# Altium project ZynqSOCHSADDA12BHS.PrjPcb
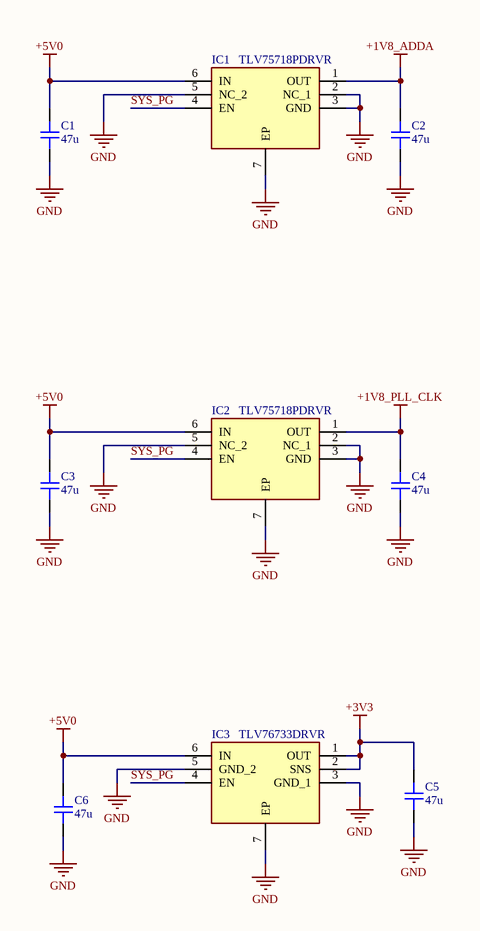
[diagram p0: HSADDAPower.SchDoc]
6 sheets, 134 parts. Net scope: global (net labels, ports and power ports of the same name join across sheets).
Board file: HSADDAModule.PcbDoc
Sheets:
  HSADDAPower.SchDoc
  MezzanineConnectors.SchDoc
  ClockGen.SchDoc
  HSADCircuit.SchDoc
  HSDACircuit.SchDoc
  SerialTerminations.SchDoc

## Sheet HSADDAPower.SchDoc
size A4; SheetNumber: 1; SheetTotal: 4

### Parts
C1  47u  [CAP_0805]
C2  47u  [CAP_0805]
C3  47u  [CAP_0805]
C4  47u  [CAP_0805]
C5  47u  [CAP_0805]
C6  47u  [CAP_0805]
IC1  TLV75718PDRVR  [SON65P200X200X80-7N]
IC2  TLV75718PDRVR  [SON65P200X200X80-7N]
IC3  TLV76733DRVR  [SON65P200X200X80-7N]

### Nets
+1V8_ADDA: C2.2 IC1.1(OUT)
+1V8_PLL_CLK: C4.2 IC2.1(OUT)
+3V3: C5.2 IC3.1(OUT) IC3.2(SNS)
+5V0: C1.2 C3.2 C6.2 IC1.6(IN) IC2.6(IN) IC3.6(IN)
GND: C1.1 C2.1 C3.1 C4.1 C5.1 C6.1 IC1.2(NC_1) IC1.3(GND) IC1.5(NC_2) IC1.7(EP) IC2.2(NC_1) IC2.3(GND) IC2.5(NC_2) IC2.7(EP) IC3.3(GND_1) IC3.5(GND_2) IC3.7(EP)
SYS_PG: IC1.4(EN) IC2.4(EN) IC3.4(EN)

### Library data of the parts
C1-C6 = CAP_0805: Capacitor SMD 0805; Manufacturer: *; Manufacturer Part Number: *; Distributor Link: *; LCSC: *; Rating: *; Dielectric: *
IC1 IC2 = TLV75718PDRVR: Integrated Circuit; Manufacturer_Name: Texas Instruments; Datasheet Link: http://www.ti.com/lit/gpn/tlv757p; Height: 0.8mm; Manufacturer_Part_Number: TLV75718PDRVR; Mouser Part Number: 595-TLV75718PDRVR; Mouser Price/Stock: https://www.mouser.co.uk/ProductDetail/Texas-Instruments/TLV75718PDRVR?qs=W0yvOO0ixfFI17Xta%2FsYdw%3D%3D; Arrow Part Number: TLV75718PDRVR; Arrow Price/Stock: https://www.arrow.com/en/products/tlv75718pdrvr/texas-instruments
IC3 = TLV76733DRVR: Integrated Circuit; Manufacturer_Name: Texas Instruments; Datasheet Link: http://www.ti.com/lit/gpn/TLV767; Height: 0.8mm; Manufacturer_Part_Number: TLV76733DRVR; Mouser Part Number: 595-TLV76733DRVR; Mouser Price/Stock: https://www.mouser.co.uk/ProductDetail/Texas-Instruments/TLV76733DRVR?qs=9r4v7xj2LnmGIkwTuPlHig%3D%3D; Arrow Part Number: TLV76733DRVR; Arrow Price/Stock: https://www.arrow.com/en/products/tlv76733drvr/texas-instruments?region=nac

## Sheet MezzanineConnectors.SchDoc
size A3; SheetNumber: 2; SheetTotal: 6
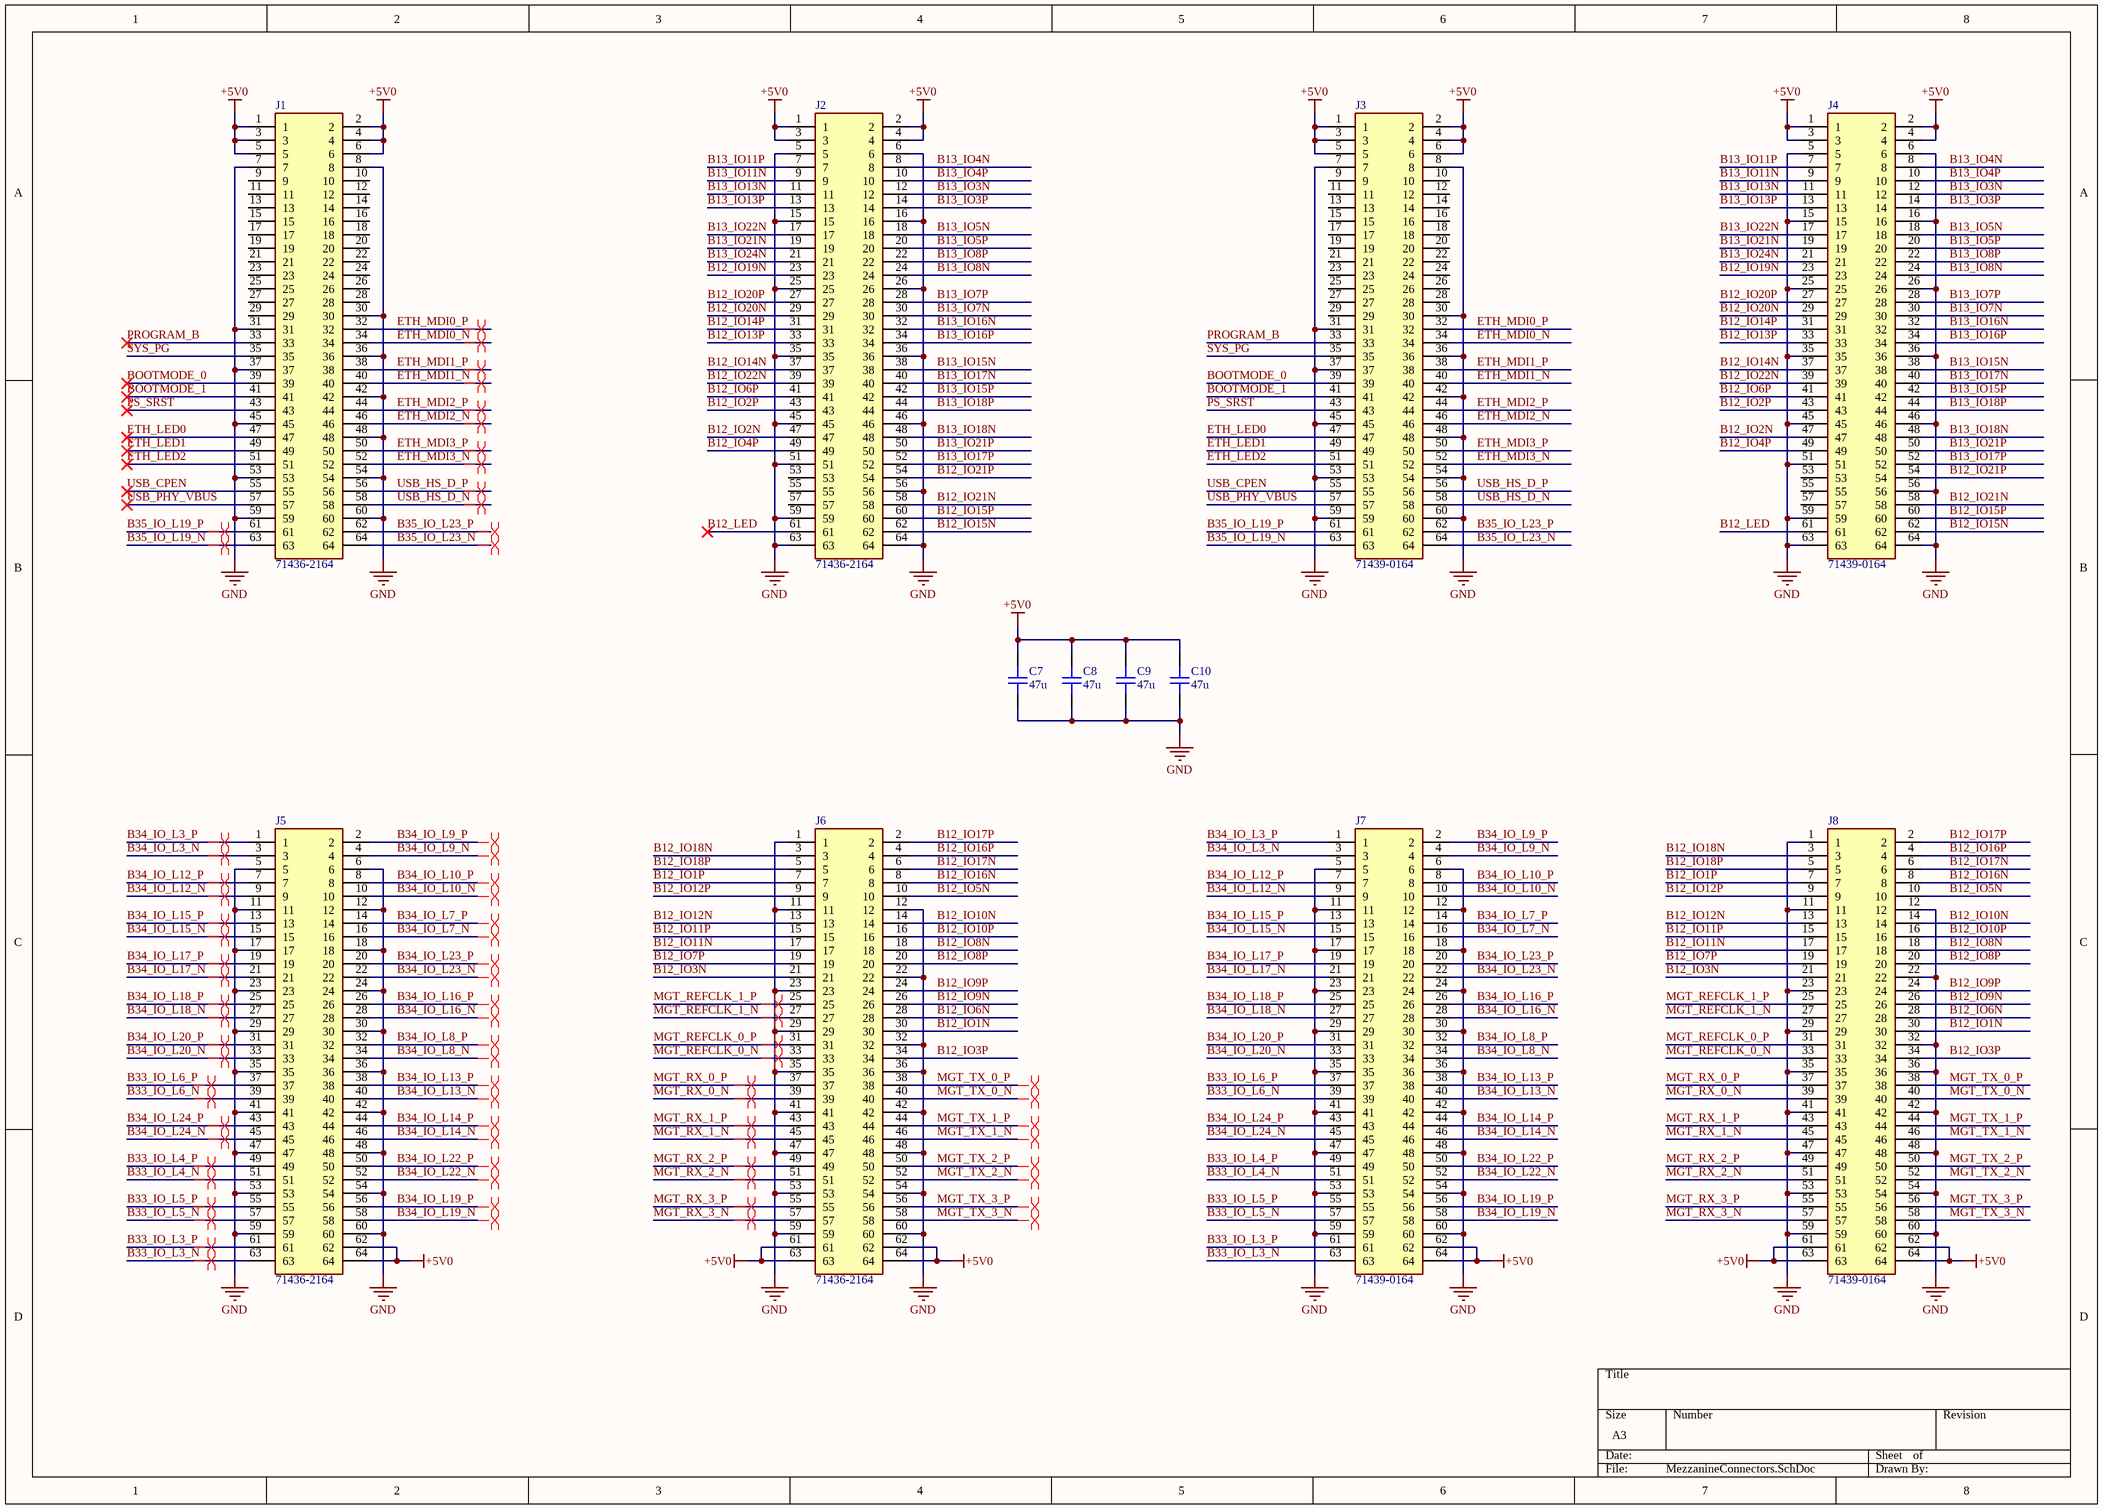
[diagram p1: MezzanineConnectors.SchDoc]

### Parts
C7  47u  [CAP_0805]
C8  47u  [CAP_0805]
C9  47u  [CAP_0805]
C10  47u  [CAP_0805]
J1  71436-2164  [714362164]
J2  71436-2164  [714362164]
J3  71439-0164  [714390164]
J4  71439-0164  [714390164]
J5  71436-2164  [714362164]
J6  71436-2164  [714362164]
J7  71439-0164  [714390164]
J8  71439-0164  [714390164]

### Nets
+5V0: C7.2 C8.2 C9.2 C10.2 J1.1 J1.2 J1.3 J1.4 J1.5 J1.6 J2.1 J2.2 J2.3 J2.4 J3.1 J3.2 J3.3 J3.4 J3.5 J3.6 J4.1 J4.2 J4.3 J4.4 J5.62 J5.64 J6.61 J6.62 J6.63 J6.64 J7.62 J7.64 J8.61 J8.62 J8.63 J8.64
GND: C7.1 C8.1 C9.1 C10.1 J1.7 J1.8 J1.30 J1.31 J1.36 J1.37 J1.42 J1.45 J1.48 J1.53 J1.54 J1.59 J1.60 J2.5 J2.6 J2.15 J2.16 J2.25 J2.26 J2.35 J2.36 J2.45 J2.46 J2.51 J2.56 J2.59 J2.63 J2.64 J3.7 J3.8 J3.30 J3.31 J3.36 J3.37 J3.42 J3.45 J3.48 J3.53 J3.54 J3.59 J3.60 J4.5 J4.6 J4.15 J4.16 J4.25 J4.26 J4.35 J4.36 J4.45 J4.46 J4.51 J4.56 J4.59 J4.63 J4.64 J5.5 J5.6 J5.11 J5.12 J5.17 J5.18 J5.23 J5.24 J5.29 J5.30 J5.35 J5.36 J5.41 J5.42 J5.47 J5.48 J5.53 J5.54 J5.59 J5.60 J6.1 J6.11 J6.12 J6.22 J6.23 J6.29 J6.32 J6.35 J6.36 J6.41 J6.42 J6.47 J6.48 J6.53 J6.54 J6.59 J6.60 J7.5 J7.6 J7.11 J7.12 J7.17 J7.18 J7.23 J7.24 J7.29 J7.30 J7.35 J7.36 J7.41 J7.42 J7.47 J7.48 J7.53 J7.54 J7.59 J7.60 J8.1 J8.11 J8.12 J8.22 J8.23 J8.29 J8.32 J8.35 J8.36 J8.41 J8.42 J8.47 J8.48 J8.53 J8.54 J8.59 J8.60
B12_IO1N: J6.30 J8.30
B12_IO1P: J6.7 J8.7
B12_IO2N: J2.47 J4.47
B12_IO2P: J2.43 J4.43
B12_IO3N: J6.21 J8.21
B12_IO3P: J6.34 J8.34
B12_IO4P: J2.49 J4.49
B12_IO5N: J6.10 J8.10
B12_IO6N: J6.28 J8.28
B12_IO6P: J2.41 J4.41
B12_IO7P: J6.19 J8.19
B12_IO8N: J6.18 J8.18
B12_IO8P: J6.20 J8.20
B12_IO9N: J6.26 J8.26
B12_IO9P: J6.24 J8.24
B12_IO10N: J6.14 J8.14
B12_IO10P: J6.16 J8.16
B12_IO11N: J6.17 J8.17
B12_IO11P: J6.15 J8.15
B12_IO12N: J6.13 J8.13
B12_IO12P: J6.9 J8.9
B12_IO13P: J2.33 J4.33
B12_IO14N: J2.37 J4.37
B12_IO14P: J2.31 J4.31
B12_IO15N: J2.62 J4.62
B12_IO15P: J2.60 J4.60
B12_IO16N: J6.8 J8.8
B12_IO16P: J6.4 J8.4
B12_IO17N: J6.6 J8.6
B12_IO17P: J6.2 J8.2
B12_IO18N: J6.3 J8.3
B12_IO18P: J6.5 J8.5
B12_IO19N: J2.23 J4.23
B12_IO20N: J2.29 J4.29
B12_IO20P: J2.27 J4.27
B12_IO21N: J2.58 J4.58
B12_IO21P: J2.54 J4.54
B12_IO22N: J2.39 J4.39
B12_LED: J2.61 J4.61
B13_IO3N: J2.12 J4.12
B13_IO3P: J2.14 J4.14
B13_IO4N: J2.8 J4.8
B13_IO4P: J2.10 J4.10
B13_IO5N: J2.18 J4.18
B13_IO5P: J2.20 J4.20
B13_IO7N: J2.30 J4.30
B13_IO7P: J2.28 J4.28
B13_IO8N: J2.24 J4.24
B13_IO8P: J2.22 J4.22
B13_IO11N: J2.9 J4.9
B13_IO11P: J2.7 J4.7
B13_IO13N: J2.11 J4.11
B13_IO13P: J2.13 J4.13
B13_IO15N: J2.38 J4.38
B13_IO15P: J2.42 J4.42
B13_IO16N: J2.32 J4.32
B13_IO16P: J2.34 J4.34
B13_IO17N: J2.40 J4.40
B13_IO17P: J2.52 J4.52
B13_IO18N: J2.48 J4.48
B13_IO18P: J2.44 J4.44
B13_IO21N: J2.19 J4.19
B13_IO21P: J2.50 J4.50
B13_IO22N: J2.17 J4.17
B13_IO24N: J2.21 J4.21
B33_IO_L3_N: J5.63 J7.63
B33_IO_L3_P: J5.61 J7.61
B33_IO_L4_N: J5.51 J7.51
B33_IO_L4_P: J5.49 J7.49
B33_IO_L5_N: J5.57 J7.57
B33_IO_L5_P: J5.55 J7.55
B33_IO_L6_N: J5.39 J7.39
B33_IO_L6_P: J5.37 J7.37
B34_IO_L3_N: J5.3 J7.3
B34_IO_L3_P: J5.1 J7.1
B34_IO_L7_N: J5.16 J7.16
B34_IO_L7_P: J5.14 J7.14
B34_IO_L8_N: J5.34 J7.34
B34_IO_L8_P: J5.32 J7.32
B34_IO_L9_N: J5.4 J7.4
B34_IO_L9_P: J5.2 J7.2
B34_IO_L10_N: J5.10 J7.10
B34_IO_L10_P: J5.8 J7.8
B34_IO_L12_N: J5.9 J7.9
B34_IO_L12_P: J5.7 J7.7
B34_IO_L13_N: J5.40 J7.40
B34_IO_L13_P: J5.38 J7.38
B34_IO_L14_N: J5.46 J7.46
B34_IO_L14_P: J5.44 J7.44
B34_IO_L15_N: J5.15 J7.15
B34_IO_L15_P: J5.13 J7.13
B34_IO_L16_N: J5.28 J7.28
B34_IO_L16_P: J5.26 J7.26
B34_IO_L17_N: J5.21 J7.21
B34_IO_L17_P: J5.19 J7.19
B34_IO_L18_N: J5.27 J7.27
B34_IO_L18_P: J5.25 J7.25
B34_IO_L19_N: J5.58 J7.58
B34_IO_L19_P: J5.56 J7.56
B34_IO_L20_N: J5.33 J7.33
B34_IO_L20_P: J5.31 J7.31
B34_IO_L22_N: J5.52 J7.52
B34_IO_L22_P: J5.50 J7.50
B34_IO_L23_N: J5.22 J7.22
B34_IO_L23_P: J5.20 J7.20
B34_IO_L24_N: J5.45 J7.45
B34_IO_L24_P: J5.43 J7.43
B35_IO_L19_N: J1.63 J3.63
B35_IO_L19_P: J1.61 J3.61
B35_IO_L23_N: J1.64 J3.64
B35_IO_L23_P: J1.62 J3.62
BOOTMODE_0: J1.39 J3.39
BOOTMODE_1: J1.41 J3.41
ETH_LED0: J1.47 J3.47
ETH_LED1: J1.49 J3.49
ETH_LED2: J1.51 J3.51
ETH_MDI0_N: J1.34 J3.34
ETH_MDI0_P: J1.32 J3.32
ETH_MDI1_N: J1.40 J3.40
ETH_MDI1_P: J1.38 J3.38
ETH_MDI2_N: J1.46 J3.46
ETH_MDI2_P: J1.44 J3.44
ETH_MDI3_N: J1.52 J3.52
ETH_MDI3_P: J1.50 J3.50
MGT_REFCLK_0_N: J6.33 J8.33
MGT_REFCLK_0_P: J6.31 J8.31
MGT_REFCLK_1_N: J6.27 J8.27
MGT_REFCLK_1_P: J6.25 J8.25
MGT_RX_0_N: J6.39 J8.39
MGT_RX_0_P: J6.37 J8.37
MGT_RX_1_N: J6.45 J8.45
MGT_RX_1_P: J6.43 J8.43
MGT_RX_2_N: J6.51 J8.51
MGT_RX_2_P: J6.49 J8.49
MGT_RX_3_N: J6.57 J8.57
MGT_RX_3_P: J6.55 J8.55
MGT_TX_0_N: J6.40 J8.40
MGT_TX_0_P: J6.38 J8.38
MGT_TX_1_N: J6.46 J8.46
MGT_TX_1_P: J6.44 J8.44
MGT_TX_2_N: J6.52 J8.52
MGT_TX_2_P: J6.50 J8.50
MGT_TX_3_N: J6.58 J8.58
MGT_TX_3_P: J6.56 J8.56
PROGRAM_B: J1.33 J3.33
PS_SRST: J1.43 J3.43
SYS_PG: J1.35 J3.35
USB_CPEN: J1.55 J3.55
USB_HS_D_N: J1.58 J3.58
USB_HS_D_P: J1.56 J3.56
USB_PHY_VBUS: J1.57 J3.57

Not connected (* = marked no-connect by the designer): J1 9 10 11 12 13 14 15 16 17 18 19 20 21 22 23 24 25 26 27 28 29; J2 53 55 57; J3 9 10 11 12 13 14 15 16 17 18 19 20 21 22 23 24 25 26 27 28 29; J4 53 55 57

### Layout directives
differential pair: B33_IO_L3_N, B33_IO_L3_P, B33_IO_L4_N, B33_IO_L4_P, B33_IO_L5_N, B33_IO_L5_P, B33_IO_L6_N, B33_IO_L6_P, B34_IO_L3_N, B34_IO_L3_P, B34_IO_L7_N, B34_IO_L7_P, B34_IO_L8_N, B34_IO_L8_P, B34_IO_L9_N, B34_IO_L9_P, B34_IO_L10_N, B34_IO_L10_P, B34_IO_L12_N, B34_IO_L12_P, B34_IO_L13_N, B34_IO_L13_P, B34_IO_L14_N, B34_IO_L14_P, B34_IO_L15_N, B34_IO_L15_P, B34_IO_L16_N, B34_IO_L16_P, B34_IO_L17_N, B34_IO_L17_P, B34_IO_L18_N, B34_IO_L18_P, B34_IO_L19_N, B34_IO_L19_P, B34_IO_L20_N, B34_IO_L20_P, B34_IO_L22_N, B34_IO_L22_P, B34_IO_L23_N, B34_IO_L23_P, B34_IO_L24_N, B34_IO_L24_P, B35_IO_L19_N, B35_IO_L19_P, B35_IO_L23_N, B35_IO_L23_P, ETH_MDI0_N, ETH_MDI0_P, ETH_MDI1_N, ETH_MDI1_P, ETH_MDI2_N, ETH_MDI2_P, ETH_MDI3_N, ETH_MDI3_P, MGT_REFCLK_0_N, MGT_REFCLK_0_P, MGT_REFCLK_1_N, MGT_REFCLK_1_P, MGT_RX_0_N, MGT_RX_0_P, MGT_RX_1_N, MGT_RX_1_P, MGT_RX_2_N, MGT_RX_2_P, MGT_RX_3_N, MGT_RX_3_P, MGT_TX_0_N, MGT_TX_0_P, MGT_TX_1_N, MGT_TX_1_P, MGT_TX_2_N, MGT_TX_2_P, MGT_TX_3_N, MGT_TX_3_P, USB_HS_D_N, USB_HS_D_P

### Library data of the parts
C7-C10 = CAP_0805: Capacitor SMD 0805; Manufacturer: *; Manufacturer Part Number: *; Distributor Link: *; LCSC: *; Rating: *; Dielectric: *
J1 J2 J5 J6 = 71436-2164: Molex MEZZANINE Series, Series Number 71436, 1mm Pitch 64 Way 2 Row Straight PCB Header, Solder Termination, 1A; Geometry.Height: 8.48mm; Mouser Part Number: 538-71436-2164; Mouser Price/Stock: https://www.mouser.co.uk/ProductDetail/Molex/71436-2164?qs=X1mjqRbeMc536fw4qEA%252B%252Bg%3D%3D; Manufacturer_Name: Molex; Manufacturer_Part_Number: 71436-2164; Datasheet Link: *
J3 J4 J7 J8 = 71439-0164: Board to Board & Mezzanine Connectors PMC RECEPTACLE SMT; Manufacturer_Name: Molex; Datasheet Link: https://componentsearchengine.com/Datasheets/1/71439-0164.pdf; Height: 5.3mm; Manufacturer_Part_Number: 71439-0164; Mouser Part Number: 538-71439-0164; Mouser Price/Stock: https://www.mouser.co.uk/ProductDetail/Molex/71439-0164?qs=X1mjqRbeMc7uGUsAO8ttVw%3D%3D

## Sheet ClockGen.SchDoc
size A4; SheetNumber: 3; SheetTotal: 6
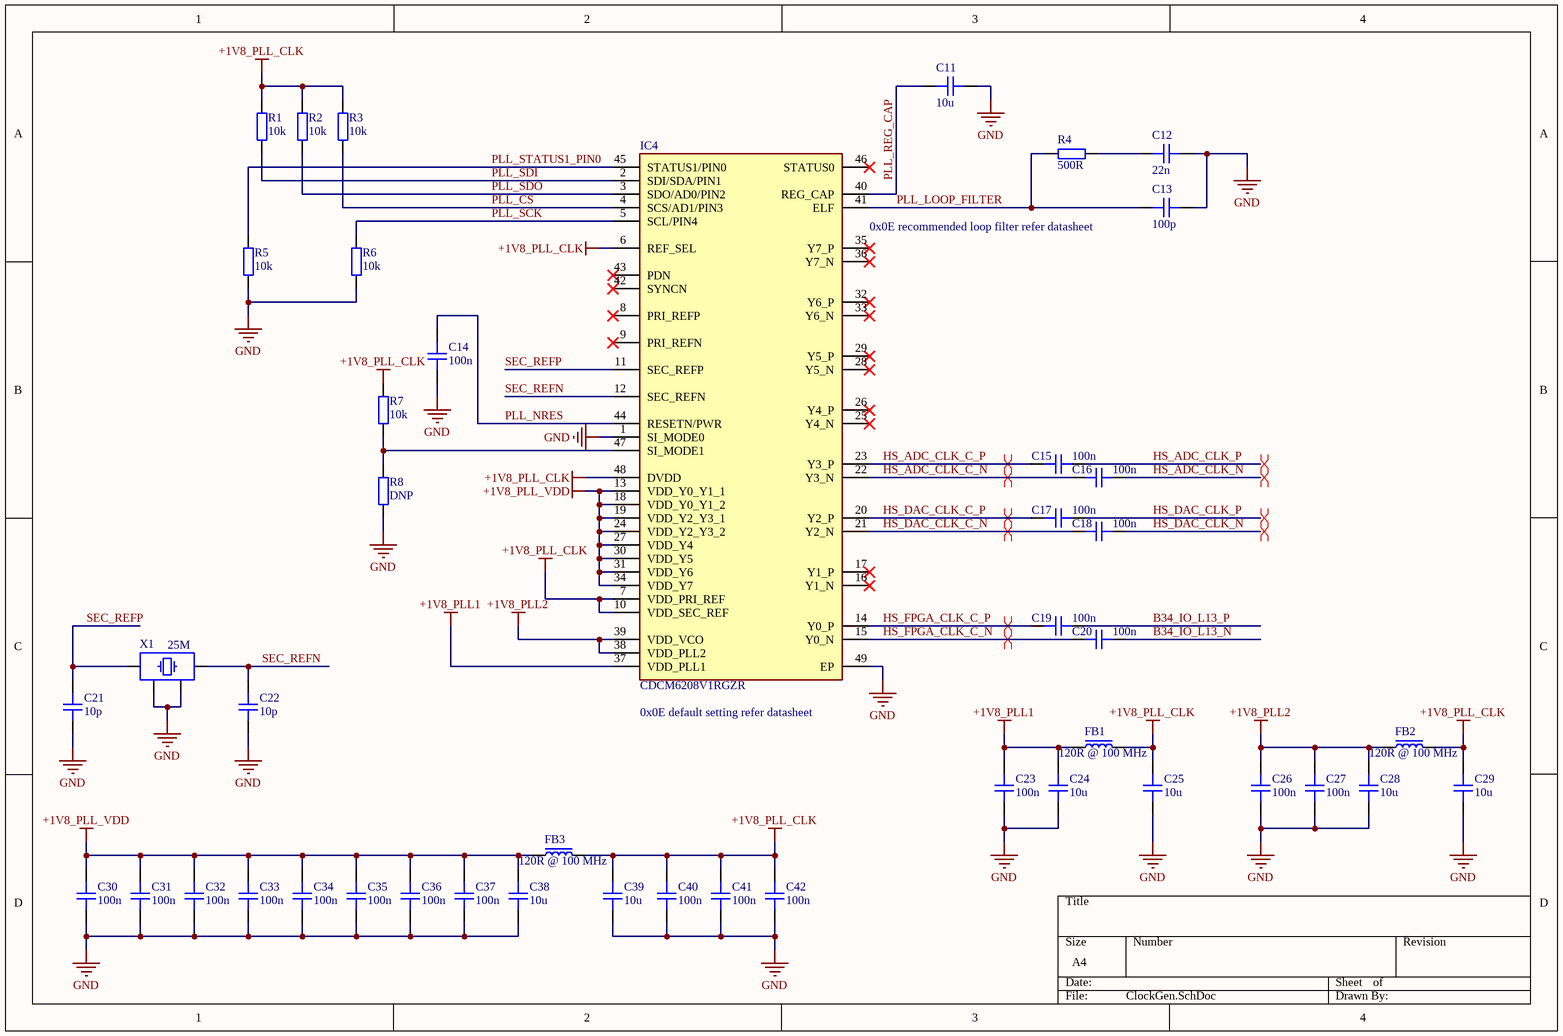
[diagram p2: ClockGen.SchDoc]

### Parts
C11  10u  [CAP_0603]
C12  22n  [CAP_0402]
C13  100p  [CAP_0402]
C14  100n  [CAP_0402]
C15  100n  [CAP_0402]
C16  100n  [CAP_0402]
C17  100n  [CAP_0402]
C18  100n  [CAP_0402]
C19  100n  [CAP_0402]
C20  100n  [CAP_0402]
C21  10p  [CAP_0402]
C22  10p  [CAP_0402]
C23  100n  [CAP_0402]
C24  10u  [CAP_0603]
C25  10u  [CAP_0603]
C26  100n  [CAP_0402]
C27  100n  [CAP_0402]
C28  10u  [CAP_0603]
C29  10u  [CAP_0603]
C30  100n  [CAP_0402]
C31  100n  [CAP_0402]
C32  100n  [CAP_0402]
C33  100n  [CAP_0402]
C34  100n  [CAP_0402]
C35  100n  [CAP_0402]
C36  100n  [CAP_0402]
C37  100n  [CAP_0402]
C38  10u  [CAP_0603]
C39  10u  [CAP_0603]
C40  100n  [CAP_0402]
C41  100n  [CAP_0402]
C42  100n  [CAP_0402]
FB1  120R @ 100 MHz  [FB_0603]
FB2  120R @ 100 MHz  [FB_0603]
FB3  120R @ 100 MHz  [FB_0603]
IC4  CDCM6208V1RGZR  [QFN50P700X700X100-49N-D - duplicate]
R1  10k  [RES_0402]
R2  10k  [RES_0402]
R3  10k  [RES_0402]
R4  500R  [RES_0402]
R5  10k  [RES_0402]
R6  10k  [RES_0402]
R7  10k  [RES_0402]
R8  DNP  [RES_0402]
X1  25M  [XTAL_3225]

### Nets
+1V8_PLL1: C23.1 C24.2 FB1.1 IC4.37(VDD_PLL1)
+1V8_PLL2: C26.1 C27.1 C28.2 FB2.1 IC4.38(VDD_PLL2) IC4.39(VDD_VCO)
+1V8_PLL_CLK: C25.2 C29.2 C39.2 C40.1 C41.1 C42.1 FB1.2 FB2.2 FB3.2 IC4.6(REF_SEL) IC4.7(VDD_PRI_REF) IC4.10(VDD_SEC_REF) IC4.48(DVDD) R1.2 R2.2 R3.2 R7.2
+1V8_PLL_VDD: C30.1 C31.1 C32.1 C33.1 C34.1 C35.1 C36.1 C37.1 C38.2 FB3.1 IC4.13(VDD_Y0_Y1_1) IC4.18(VDD_Y0_Y1_2) IC4.19(VDD_Y2_Y3_1) IC4.24(VDD_Y2_Y3_2) IC4.27(VDD_Y4) IC4.30(VDD_Y5) IC4.31(VDD_Y6) IC4.34(VDD_Y7)
GND: C11.2 C12.1 C13.1 C14.1 C21.2 C22.2 C23.2 C24.1 C25.1 C26.2 C27.2 C28.1 C29.1 C30.2 C31.2 C32.2 C33.2 C34.2 C35.2 C36.2 C37.2 C38.1 C39.1 C40.2 C41.2 C42.2 IC4.1(SI_MODE0) IC4.49(EP) R5.1 R6.1 R8.1 X1.2 X1.4
B34_IO_L13_N: C20.1
B34_IO_L13_P: C19.1
HS_ADC_CLK_C_N: C16.2 IC4.22(Y3_N)
HS_ADC_CLK_C_P: C15.2 IC4.23(Y3_P)
HS_ADC_CLK_N: C16.1
HS_ADC_CLK_P: C15.1
HS_DAC_CLK_C_N: C18.2 IC4.21(Y2_N)
HS_DAC_CLK_C_P: C17.2 IC4.20(Y2_P)
HS_DAC_CLK_N: C18.1
HS_DAC_CLK_P: C17.1
HS_FPGA_CLK_C_N: C20.2 IC4.15(Y0_N)
HS_FPGA_CLK_C_P: C19.2 IC4.14(Y0_P)
PLL_CS: IC4.4(SCS/AD1/PIN3) R3.1
PLL_LOOP_FILTER: C13.2 IC4.41(ELF) R4.2
PLL_NRES: C14.2 IC4.44(RESETN/PWR)
PLL_REG_CAP: C11.1 IC4.40(REG_CAP)
PLL_SCK: IC4.5(SCL/PIN4) R6.2
PLL_SDI: IC4.2(SDI/SDA/PIN1) R1.1
PLL_SDO: IC4.3(SDO/AD0/PIN2) R2.1
PLL_STATUS1_PIN0: IC4.45(STATUS1/PIN0) R5.2
SEC_REFN: C22.1 IC4.12(SEC_REFN) X1.3
SEC_REFP: C21.1 IC4.11(SEC_REFP) X1.1
NetC12_2: C12.2 R4.1
NetIC4_47: IC4.47(SI_MODE1) R7.1 R8.2

Not connected (* = marked no-connect by the designer): IC4 8(PRI_REFP)* 9(PRI_REFN)* 16(Y1_N)* 17(Y1_P)* 25(Y4_N)* 26(Y4_P)* 28(Y5_N)* 29(Y5_P)* 32(Y6_P)* 33(Y6_N)* 35(Y7_P)* 36(Y7_N)* 42(SYNCN)* 43(PDN)* 46(STATUS0)*

### Layout directives
differential pair: HS_ADC_CLK_C_N, HS_ADC_CLK_C_P, HS_ADC_CLK_N, HS_ADC_CLK_P, HS_DAC_CLK_C_N, HS_DAC_CLK_C_P, HS_DAC_CLK_N, HS_DAC_CLK_P, HS_FPGA_CLK_C_N, HS_FPGA_CLK_C_P

### Notes on the sheet
- 0x0E recommended loop filter refer datasheet
- (near IC4) 0x0E default setting refer datasheet

### Library data of the parts
C11 C24 C25 C28 C29 C38 C39 = CAP_0603: Capacitor SMD 0603; Manufacturer: *; Manufacturer Part Number: *; Distributor Link: *; LCSC: *; Rating: *; Dielectric: *
C12-C23 C26 C27 C30-C37 C40-C42 = CAP_0402: Capacitor SMD 0402; Manufacturer: *; Manufacturer Part Number: *; Distributor Link: *; LCSC: *; Rating: *; Dielectric: *
FB1-FB3 = FB_0603: Ferrite Bead SMD 0603; Manufacturer: *; Manufacturer Part Number: *; Distributor Link: *; LCSC: *
IC4 = CDCM6208V1RGZR: Integrated Circuit; Manufacturer_Name: Texas Instruments; Datasheet Link: http://www.ti.com/lit/gpn/cdcm6208; Height: 1mm; Manufacturer_Part_Number: CDCM6208V1RGZR; Mouser Part Number: 595-CDCM6208V1RGZR; Mouser Price/Stock: https://www.mouser.co.uk/ProductDetail/Texas-Instruments/CDCM6208V1RGZR?qs=Zv8nmyeoaKuA7Z6bIfs9ug%3D%3D; Arrow Part Number: CDCM6208V1RGZR; Arrow Price/Stock: https://www.arrow.com/en/products/cdcm6208v1rgzr/texas-instruments?region=nac
R1-R8 = RES_0402: Resistor SMD 0402; Manufacturer: *; Manufacturer Part Number: *; Distributor Link: *; LCSC: *
X1 = XTAL_3225: Crystal SMD 3225; Distributor Link: *

## Sheet HSADCircuit.SchDoc
size A4; SheetNumber: 4; SheetTotal: 6
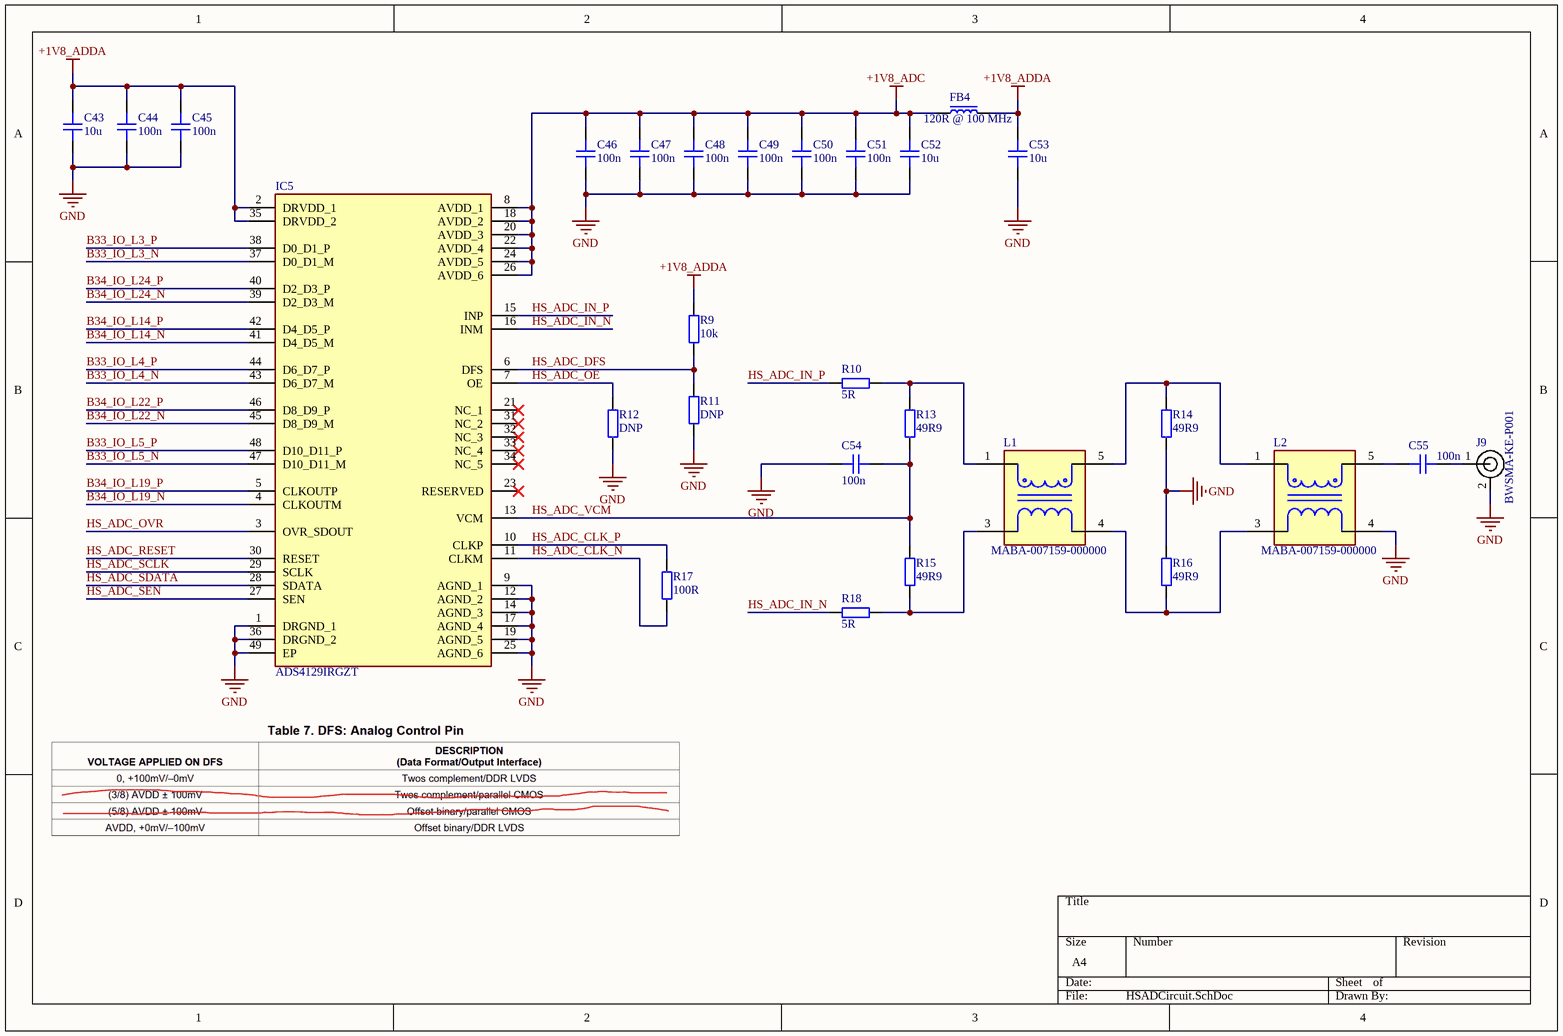
[diagram p3: HSADCircuit.SchDoc]

### Parts
C43  10u  [CAP_0603]
C44  100n  [CAP_0402]
C45  100n  [CAP_0402]
C46  100n  [CAP_0402]
C47  100n  [CAP_0402]
C48  100n  [CAP_0402]
C49  100n  [CAP_0402]
C50  100n  [CAP_0402]
C51  100n  [CAP_0402]
C52  10u  [CAP_0603]
C53  10u  [CAP_0603]
C54  100n  [CAP_0402]
C55  100n  [CAP_0402]
FB4  120R @ 100 MHz  [FB_0603]
IC5  ADS4129IRGZT  [QFN50P700X700X100-49N-D]
J9  BWSMA-KE-P001  [BWSMA-KE-P001]
L1  MABA-007159-000000  [FP-MABA-007159-000000-MFG]
L2  MABA-007159-000000  [FP-MABA-007159-000000-MFG]
R9  10k  [RES_0402]
R10  5R  [RES_0402]
R11  DNP  [RES_0402]
R12  DNP  [RES_0402]
R13  49R9  [RES_0402]
R14  49R9  [RES_0402]
R15  49R9  [RES_0402]
R16  49R9  [RES_0402]
R17  100R  [RES_0402]
R18  5R  [RES_0402]

### Nets
+1V8_ADC: C46.1 C47.1 C48.1 C49.1 C50.1 C51.1 C52.2 FB4.1 IC5.8(AVDD_1) IC5.18(AVDD_2) IC5.20(AVDD_3) IC5.22(AVDD_4) IC5.24(AVDD_5) IC5.26(AVDD_6)
+1V8_ADDA: C43.2 C44.1 C45.1 C53.2 FB4.2 IC5.2(DRVDD_1) IC5.35(DRVDD_2) R9.2
GND: C43.1 C44.2 C45.2 C46.2 C47.2 C48.2 C49.2 C50.2 C51.2 C52.1 C53.1 C54.2 IC5.1(DRGND_1) IC5.9(AGND_1) IC5.12(AGND_2) IC5.14(AGND_3) IC5.17(AGND_4) IC5.19(AGND_5) IC5.25(AGND_6) IC5.36(DRGND_2) IC5.49(EP) J9.2 L2.4(Primary) R11.1 R12.1 R14.2 R16.1
B33_IO_L3_N: IC5.37(D0_D1_M)
B33_IO_L3_P: IC5.38(D0_D1_P)
B33_IO_L4_N: IC5.43(D6_D7_M)
B33_IO_L4_P: IC5.44(D6_D7_P)
B33_IO_L5_N: IC5.47(D10_D11_M)
B33_IO_L5_P: IC5.48(D10_D11_P)
B34_IO_L14_N: IC5.41(D4_D5_M)
B34_IO_L14_P: IC5.42(D4_D5_P)
B34_IO_L19_N: IC5.4(CLKOUTM)
B34_IO_L19_P: IC5.5(CLKOUTP)
B34_IO_L22_N: IC5.45(D8_D9_M)
B34_IO_L22_P: IC5.46(D8_D9_P)
B34_IO_L24_N: IC5.39(D2_D3_M)
B34_IO_L24_P: IC5.40(D2_D3_P)
HS_ADC_CLK_N: IC5.11(CLKM) R17.1
HS_ADC_CLK_P: IC5.10(CLKP) R17.2
HS_ADC_DFS: IC5.6(DFS) R9.1 R11.2
HS_ADC_IN_N: IC5.16(INM) R18.2
HS_ADC_IN_P: IC5.15(INP) R10.2
HS_ADC_OE: IC5.7(OE) R12.2
HS_ADC_OVR: IC5.3(OVR_SDOUT)
HS_ADC_RESET: IC5.30(RESET)
HS_ADC_SCLK: IC5.29(SCLK)
HS_ADC_SDATA: IC5.28(SDATA)
HS_ADC_SEN: IC5.27(SEN)
HS_ADC_VCM: C54.1 IC5.13(VCM) R13.2 R15.1
NetC55_1: C55.1 L2.5(Primary_Dot)
NetC55_2: C55.2 J9.1
NetL1_1: L1.1(Secondary_Dot) R10.1 R13.1
NetL1_3: L1.3(Secondary) R15.2 R18.1
NetL1_4: L1.4(Primary) L2.3(Secondary) R16.2
NetL1_5: L1.5(Primary_Dot) L2.1(Secondary_Dot) R14.1

Not connected (* = marked no-connect by the designer): IC5 21(NC_1)* 23(RESERVED)* 31(NC_2)* 32(NC_3)* 33(NC_4)* 34(NC_5)*

### Library data of the parts
C43 C52 C53 = CAP_0603: Capacitor SMD 0603; Manufacturer: *; Manufacturer Part Number: *; Distributor Link: *; LCSC: *; Rating: *; Dielectric: *
C44-C51 C54 C55 = CAP_0402: Capacitor SMD 0402; Manufacturer: *; Manufacturer Part Number: *; Distributor Link: *; LCSC: *; Rating: *; Dielectric: *
FB4 = FB_0603: Ferrite Bead SMD 0603; Manufacturer: *; Manufacturer Part Number: *; Distributor Link: *; LCSC: *
IC5 = ADS4129IRGZT: Integrated Circuit; Manufacturer_Name: Texas Instruments; Datasheet Link: http://www.ti.com/lit/gpn/ads4129; Height: 1mm; Manufacturer_Part_Number: ADS4129IRGZT; Mouser Part Number: 595-ADS4129IRGZT; Mouser Price/Stock: https://www.mouser.co.uk/ProductDetail/Texas-Instruments/ADS4129IRGZT?qs=%2Fqzd9s%252BcLd6SvRsOYifvuQ%3D%3D; Arrow Part Number: ADS4129IRGZT; Arrow Price/Stock: https://www.arrow.com/en/products/ads4129irgzt/texas-instruments?region=nac
L1 L2 = MABA-007159-000000: BALUN 4.5MHZ-3GHZ 1:1 6SMD FLAT; Power Rating: 250mW; Max DC Current: 30mA; Lead/Base Style: Gull Wing; Depth: 3.81mm; Lead Free: Lead Free; Turns Ratio: 1:1; Case/Package: SMD/SMT; Min Operating Temperature: -40°C; Length: 3.81mm; Width: 3.81mm; Mount: Surface Mount; Radiation Hardening: No; Number of Pins: 5; RoHS Compliant: Yes; Max Operating Temperature: 85°C; Termination: SMD/SMT; Height: 2.67mm; Packaging: Cut Tape; Package Quantity: 2000; Series: -
R9-R18 = RES_0402: Resistor SMD 0402; Manufacturer: *; Manufacturer Part Number: *; Distributor Link: *; LCSC: *

## Sheet HSDACircuit.SchDoc
size A4; SheetNumber: 5; SheetTotal: 6
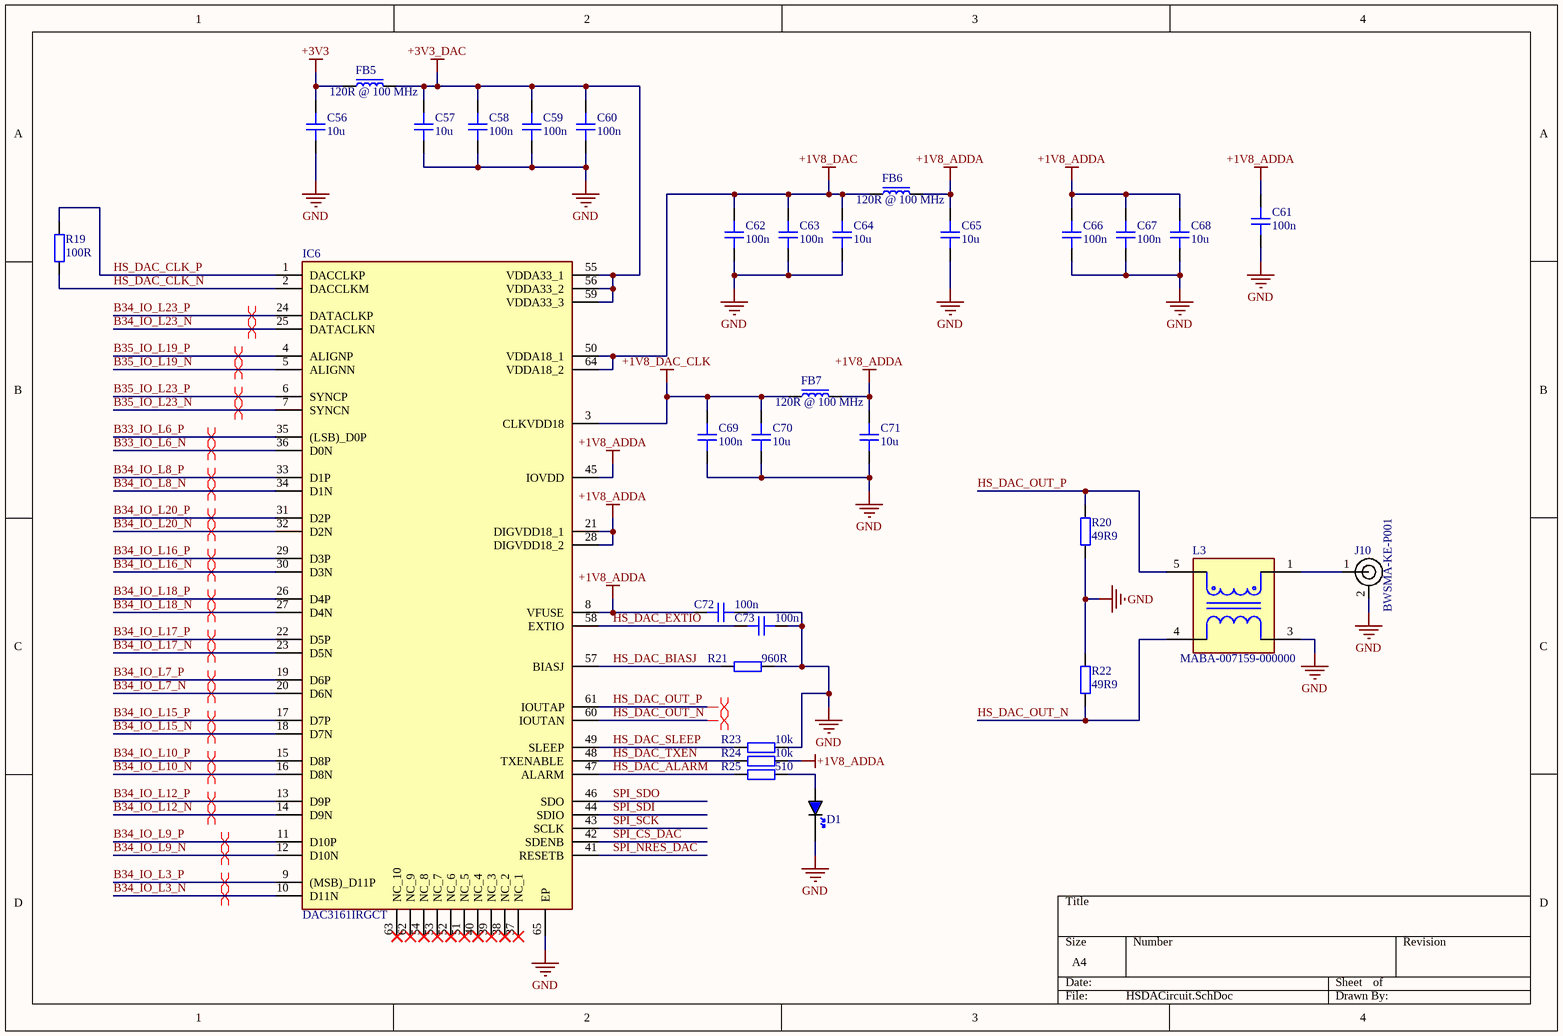
[diagram p4: HSDACircuit.SchDoc]

### Parts
C56  10u  [CAP_0603]
C57  10u  [CAP_0603]
C58  100n  [CAP_0402]
C59  100n  [CAP_0402]
C60  100n  [CAP_0402]
C61  100n  [CAP_0402]
C62  100n  [CAP_0402]
C63  100n  [CAP_0402]
C64  10u  [CAP_0603]
C65  10u  [CAP_0603]
C66  100n  [CAP_0402]
C67  100n  [CAP_0402]
C68  10u  [CAP_0603]
C69  100n  [CAP_0402]
C70  10u  [CAP_0603]
C71  10u  [CAP_0603]
C72  100n  [CAP_0402]
C73  100n  [CAP_0402]
D1  BLUE  [LED_0603_BLUE]  (value not drawn)
FB5  120R @ 100 MHz  [FB_0603]
FB6  120R @ 100 MHz  [FB_0603]
FB7  120R @ 100 MHz  [FB_0603]
IC6  DAC3161IRGCT  [QFN50P900X900X100-65N-D]
J10  BWSMA-KE-P001  [BWSMA-KE-P001]
L3  MABA-007159-000000  [FP-MABA-007159-000000-MFG]
R19  100R  [RES_0402]
R20  49R9  [RES_0402]
R21  960R  [RES_0402]
R22  49R9  [RES_0402]
R23  10k  [RES_0402]
R24  10k  [RES_0402]
R25  510  [RES_0603]

### Nets
+1V8_ADDA: C61.1 C65.2 C66.1 C67.1 C68.2 C71.2 C72.1 FB6.2 FB7.2 IC6.8(VFUSE) IC6.21(DIGVDD18_1) IC6.28(DIGVDD18_2) IC6.45(IOVDD) R24.1
+1V8_DAC: C62.1 C63.1 C64.2 FB6.1 IC6.50(VDDA18_1) IC6.64(VDDA18_2)
+1V8_DAC_CLK: C69.1 C70.2 FB7.1 IC6.3(CLKVDD18)
+3V3: C56.2 FB5.2
+3V3_DAC: C57.2 C58.1 C59.1 C60.1 FB5.1 IC6.55(VDDA33_1) IC6.56(VDDA33_2) IC6.59(VDDA33_3)
GND: C56.1 C57.1 C58.2 C59.2 C60.2 C61.2 C62.2 C63.2 C64.1 C65.1 C66.2 C67.2 C68.1 C69.2 C70.1 C71.1 C72.2 C73.2 D1.K IC6.65(EP) J10.2 L3.3(Secondary) R20.2 R21.1 R22.1 R23.1
B33_IO_L6_N: IC6.36(D0N)
B33_IO_L6_P: IC6.35((LSB)_D0P)
B34_IO_L3_N: IC6.10(D11N)
B34_IO_L3_P: IC6.9((MSB)_D11P)
B34_IO_L7_N: IC6.20(D6N)
B34_IO_L7_P: IC6.19(D6P)
B34_IO_L8_N: IC6.34(D1N)
B34_IO_L8_P: IC6.33(D1P)
B34_IO_L9_N: IC6.12(D10N)
B34_IO_L9_P: IC6.11(D10P)
B34_IO_L10_N: IC6.16(D8N)
B34_IO_L10_P: IC6.15(D8P)
B34_IO_L12_N: IC6.14(D9N)
B34_IO_L12_P: IC6.13(D9P)
B34_IO_L15_N: IC6.18(D7N)
B34_IO_L15_P: IC6.17(D7P)
B34_IO_L16_N: IC6.30(D3N)
B34_IO_L16_P: IC6.29(D3P)
B34_IO_L17_N: IC6.23(D5N)
B34_IO_L17_P: IC6.22(D5P)
B34_IO_L18_N: IC6.27(D4N)
B34_IO_L18_P: IC6.26(D4P)
B34_IO_L20_N: IC6.32(D2N)
B34_IO_L20_P: IC6.31(D2P)
B34_IO_L23_N: IC6.25(DATACLKN)
B34_IO_L23_P: IC6.24(DATACLKP)
B35_IO_L19_N: IC6.5(ALIGNN)
B35_IO_L19_P: IC6.4(ALIGNP)
B35_IO_L23_N: IC6.7(SYNCN)
B35_IO_L23_P: IC6.6(SYNCP)
HS_DAC_ALARM: IC6.47(ALARM) R25.1
HS_DAC_BIASJ: IC6.57(BIASJ) R21.2
HS_DAC_CLK_N: IC6.2(DACCLKM) R19.1
HS_DAC_CLK_P: IC6.1(DACCLKP) R19.2
HS_DAC_EXTIO: C73.1 IC6.58(EXTIO)
HS_DAC_OUT_N: IC6.60(IOUTAN) L3.4(Primary) R22.2
HS_DAC_OUT_P: IC6.61(IOUTAP) L3.5(Primary_Dot) R20.1
HS_DAC_SLEEP: IC6.49(SLEEP) R23.2
HS_DAC_TXEN: IC6.48(TXENABLE) R24.2
SPI_CS_DAC: IC6.42(SDENB)
SPI_NRES_DAC: IC6.41(RESETB)
SPI_SCK: IC6.43(SCLK)
SPI_SDI: IC6.44(SDIO)
SPI_SDO: IC6.46(SDO)
NetD1_A: D1.A R25.2
NetJ10_1: J10.1 L3.1(Secondary_Dot)

Not connected (* = marked no-connect by the designer): IC6 37(NC_1)* 38(NC_2)* 39(NC_3)* 40(NC_4)* 51(NC_5)* 52(NC_6)* 53(NC_7)* 54(NC_8)* 62(NC_9)* 63(NC_10)*

### Layout directives
differential pair: B33_IO_L6_N, B33_IO_L6_P, B34_IO_L3_N, B34_IO_L3_P, B34_IO_L7_N, B34_IO_L7_P, B34_IO_L8_N, B34_IO_L8_P, B34_IO_L9_N, B34_IO_L9_P, B34_IO_L10_N, B34_IO_L10_P, B34_IO_L12_N, B34_IO_L12_P, B34_IO_L15_N, B34_IO_L15_P, B34_IO_L16_N, B34_IO_L16_P, B34_IO_L17_N, B34_IO_L17_P, B34_IO_L18_N, B34_IO_L18_P, B34_IO_L20_N, B34_IO_L20_P, B34_IO_L23_N, B34_IO_L23_P, B35_IO_L19_N, B35_IO_L19_P, B35_IO_L23_N, B35_IO_L23_P, HS_DAC_OUT_N, HS_DAC_OUT_P

### Library data of the parts
C56 C57 C64 C65 C68 C70 C71 = CAP_0603: Capacitor SMD 0603; Manufacturer: *; Manufacturer Part Number: *; Distributor Link: *; LCSC: *; Rating: *; Dielectric: *
C58-C63 C66 C67 C69 C72 C73 = CAP_0402: Capacitor SMD 0402; Manufacturer: *; Manufacturer Part Number: *; Distributor Link: *; LCSC: *; Rating: *; Dielectric: *
D1 = LED_0603_BLUE: LED 0603 BLUE SMD
FB5-FB7 = FB_0603: Ferrite Bead SMD 0603; Manufacturer: *; Manufacturer Part Number: *; Distributor Link: *; LCSC: *
IC6 = DAC3161IRGCT: Integrated Circuit; Manufacturer_Name: Texas Instruments; Datasheet Link: http://www.ti.com/lit/gpn/dac3161; Height: 1mm; Manufacturer_Part_Number: DAC3161IRGCT; Mouser Part Number: 595-DAC3161IRGCT; Mouser Price/Stock: https://www.mouser.com/Search/Refine.aspx?Keyword=595-DAC3161IRGCT
L3 = MABA-007159-000000: as L1 on sheet HSADCircuit; Depth: 3.81mm; Lead Free: Lead Free; Turns Ratio: 1:1; Case/Package: SMD/SMT; Min Operating Temperature: -40°C; Length: 3.81mm; Width: 3.81mm; Mount: Surface Mount; Radiation Hardening: No; Number of Pins: 5; RoHS Compliant: Yes; Max Operating Temperature: 85°C; Termination: SMD/SMT; Height: 2.67mm; Packaging: Cut Tape; Package Quantity: 2000; Series: -
R19-R24 = RES_0402: Resistor SMD 0402; Manufacturer: *; Manufacturer Part Number: *; Distributor Link: *; LCSC: *
R25 = RES_0603: Resistor SMD 0603; Manufacturer: *; Manufacturer Part Number: *; Distributor Link: *; LCSC: *

## Sheet SerialTerminations.SchDoc
size A4; SheetNumber: 6; SheetTotal: 6
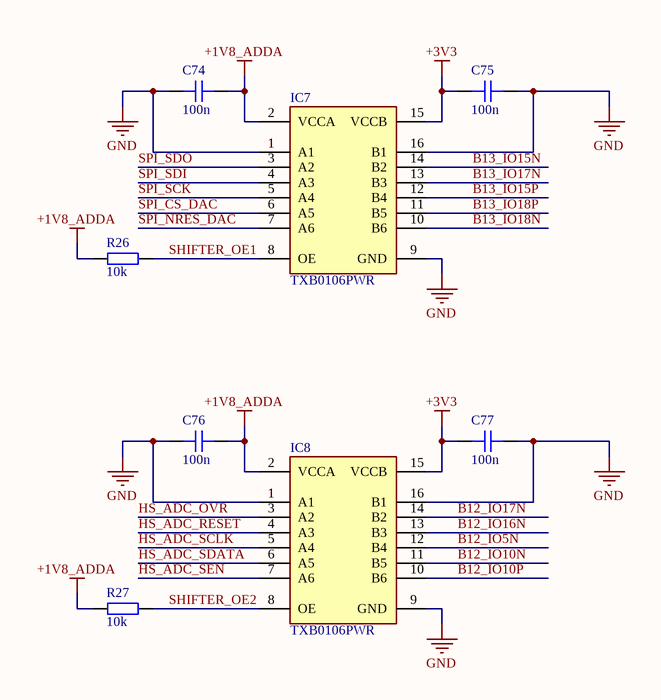
[diagram p5: SerialTerminations.SchDoc]

### Parts
C74  100n  [CAP_0402]
C75  100n  [CAP_0402]
C76  100n  [CAP_0402]
C77  100n  [CAP_0402]
IC7  TXB0106PWR  [SOP65P640X120-16N]
IC8  TXB0106PWR  [SOP65P640X120-16N]
R26  10k  [RES_0402]
R27  10k  [RES_0402]

### Nets
+1V8_ADDA: C74.2 C76.2 IC7.2(VCCA) IC8.2(VCCA) R26.1 R27.1
+3V3: C75.1 C77.1 IC7.15(VCCB) IC8.15(VCCB)
GND: C74.1 C75.2 C76.1 C77.2 IC7.1(A1) IC7.9(GND) IC7.16(B1) IC8.1(A1) IC8.9(GND) IC8.16(B1)
B12_IO5N: IC8.12(B4)
B12_IO10N: IC8.11(B5)
B12_IO10P: IC8.10(B6)
B12_IO16N: IC8.13(B3)
B12_IO17N: IC8.14(B2)
B13_IO15N: IC7.14(B2)
B13_IO15P: IC7.12(B4)
B13_IO17N: IC7.13(B3)
B13_IO18N: IC7.10(B6)
B13_IO18P: IC7.11(B5)
HS_ADC_OVR: IC8.3(A2)
HS_ADC_RESET: IC8.4(A3)
HS_ADC_SCLK: IC8.5(A4)
HS_ADC_SDATA: IC8.6(A5)
HS_ADC_SEN: IC8.7(A6)
SHIFTER_OE1: IC7.8(OE) R26.2
SHIFTER_OE2: IC8.8(OE) R27.2
SPI_CS_DAC: IC7.6(A5)
SPI_NRES_DAC: IC7.7(A6)
SPI_SCK: IC7.5(A4)
SPI_SDI: IC7.4(A3)
SPI_SDO: IC7.3(A2)

### Library data of the parts
C74-C77 = CAP_0402: Capacitor SMD 0402; Manufacturer: *; Manufacturer Part Number: *; Distributor Link: *; LCSC: *; Rating: *; Dielectric: *
IC7 IC8 = TXB0106PWR: Integrated Circuit; Manufacturer_Name: Texas Instruments; Datasheet Link: http://www.ti.com/lit/ds/symlink/txb0106.pdf; Height: 1.2mm; Manufacturer_Part_Number: TXB0106PWR; Mouser Part Number: 595-TXB0106PWR; Mouser Price/Stock: https://www.mouser.co.uk/ProductDetail/Texas-Instruments/TXB0106PWR?qs=nRD1PKnFC2EFAtrwfAB%2F4Q%3D%3D; Arrow Part Number: TXB0106PWR; Arrow Price/Stock: https://www.arrow.com/en/products/txb0106pwr/texas-instruments?utm_currency=USD&region=nac
R26 R27 = RES_0402: Resistor SMD 0402; Manufacturer: *; Manufacturer Part Number: *; Distributor Link: *; LCSC: *

## Nets that join several sheets
+1V8_ADDA: HSADDAPower (C2.2 IC1.1), HSADCircuit (8 pins), HSDACircuit (14 pins), SerialTerminations (6 pins)
+1V8_PLL_CLK: HSADDAPower (C4.2 IC2.1), ClockGen (17 pins)
+3V3: HSADDAPower (C5.2 IC3.1 IC3.2), HSDACircuit (C56.2 FB5.2), SerialTerminations (C75.1 C77.1 IC7.15 IC8.15)
+5V0: HSADDAPower (6 pins), MezzanineConnectors (36 pins)
GND: HSADDAPower (17 pins), MezzanineConnectors (134 pins), ClockGen (33 pins), HSADCircuit (27 pins), HSDACircuit (26 pins), SerialTerminations (10 pins)
B12_IO5N: MezzanineConnectors (J6.10 J8.10), SerialTerminations (IC8.12)
B12_IO10N: MezzanineConnectors (J6.14 J8.14), SerialTerminations (IC8.11)
B12_IO10P: MezzanineConnectors (J6.16 J8.16), SerialTerminations (IC8.10)
B12_IO16N: MezzanineConnectors (J6.8 J8.8), SerialTerminations (IC8.13)
B12_IO17N: MezzanineConnectors (J6.6 J8.6), SerialTerminations (IC8.14)
B13_IO15N: MezzanineConnectors (J2.38 J4.38), SerialTerminations (IC7.14)
B13_IO15P: MezzanineConnectors (J2.42 J4.42), SerialTerminations (IC7.12)
B13_IO17N: MezzanineConnectors (J2.40 J4.40), SerialTerminations (IC7.13)
B13_IO18N: MezzanineConnectors (J2.48 J4.48), SerialTerminations (IC7.10)
B13_IO18P: MezzanineConnectors (J2.44 J4.44), SerialTerminations (IC7.11)
B33_IO_L3_N: MezzanineConnectors (J5.63 J7.63), HSADCircuit (IC5.37)
B33_IO_L3_P: MezzanineConnectors (J5.61 J7.61), HSADCircuit (IC5.38)
B33_IO_L4_N: MezzanineConnectors (J5.51 J7.51), HSADCircuit (IC5.43)
B33_IO_L4_P: MezzanineConnectors (J5.49 J7.49), HSADCircuit (IC5.44)
B33_IO_L5_N: MezzanineConnectors (J5.57 J7.57), HSADCircuit (IC5.47)
B33_IO_L5_P: MezzanineConnectors (J5.55 J7.55), HSADCircuit (IC5.48)
B33_IO_L6_N: MezzanineConnectors (J5.39 J7.39), HSDACircuit (IC6.36)
B33_IO_L6_P: MezzanineConnectors (J5.37 J7.37), HSDACircuit (IC6.35)
B34_IO_L3_N: MezzanineConnectors (J5.3 J7.3), HSDACircuit (IC6.10)
B34_IO_L3_P: MezzanineConnectors (J5.1 J7.1), HSDACircuit (IC6.9)
B34_IO_L7_N: MezzanineConnectors (J5.16 J7.16), HSDACircuit (IC6.20)
B34_IO_L7_P: MezzanineConnectors (J5.14 J7.14), HSDACircuit (IC6.19)
B34_IO_L8_N: MezzanineConnectors (J5.34 J7.34), HSDACircuit (IC6.34)
B34_IO_L8_P: MezzanineConnectors (J5.32 J7.32), HSDACircuit (IC6.33)
B34_IO_L9_N: MezzanineConnectors (J5.4 J7.4), HSDACircuit (IC6.12)
B34_IO_L9_P: MezzanineConnectors (J5.2 J7.2), HSDACircuit (IC6.11)
B34_IO_L10_N: MezzanineConnectors (J5.10 J7.10), HSDACircuit (IC6.16)
B34_IO_L10_P: MezzanineConnectors (J5.8 J7.8), HSDACircuit (IC6.15)
B34_IO_L12_N: MezzanineConnectors (J5.9 J7.9), HSDACircuit (IC6.14)
B34_IO_L12_P: MezzanineConnectors (J5.7 J7.7), HSDACircuit (IC6.13)
B34_IO_L13_N: MezzanineConnectors (J5.40 J7.40), ClockGen (C20.1)
B34_IO_L13_P: MezzanineConnectors (J5.38 J7.38), ClockGen (C19.1)
B34_IO_L14_N: MezzanineConnectors (J5.46 J7.46), HSADCircuit (IC5.41)
B34_IO_L14_P: MezzanineConnectors (J5.44 J7.44), HSADCircuit (IC5.42)
B34_IO_L15_N: MezzanineConnectors (J5.15 J7.15), HSDACircuit (IC6.18)
B34_IO_L15_P: MezzanineConnectors (J5.13 J7.13), HSDACircuit (IC6.17)
B34_IO_L16_N: MezzanineConnectors (J5.28 J7.28), HSDACircuit (IC6.30)
B34_IO_L16_P: MezzanineConnectors (J5.26 J7.26), HSDACircuit (IC6.29)
B34_IO_L17_N: MezzanineConnectors (J5.21 J7.21), HSDACircuit (IC6.23)
B34_IO_L17_P: MezzanineConnectors (J5.19 J7.19), HSDACircuit (IC6.22)
B34_IO_L18_N: MezzanineConnectors (J5.27 J7.27), HSDACircuit (IC6.27)
B34_IO_L18_P: MezzanineConnectors (J5.25 J7.25), HSDACircuit (IC6.26)
B34_IO_L19_N: MezzanineConnectors (J5.58 J7.58), HSADCircuit (IC5.4)
B34_IO_L19_P: MezzanineConnectors (J5.56 J7.56), HSADCircuit (IC5.5)
B34_IO_L20_N: MezzanineConnectors (J5.33 J7.33), HSDACircuit (IC6.32)
B34_IO_L20_P: MezzanineConnectors (J5.31 J7.31), HSDACircuit (IC6.31)
B34_IO_L22_N: MezzanineConnectors (J5.52 J7.52), HSADCircuit (IC5.45)
B34_IO_L22_P: MezzanineConnectors (J5.50 J7.50), HSADCircuit (IC5.46)
B34_IO_L23_N: MezzanineConnectors (J5.22 J7.22), HSDACircuit (IC6.25)
B34_IO_L23_P: MezzanineConnectors (J5.20 J7.20), HSDACircuit (IC6.24)
B34_IO_L24_N: MezzanineConnectors (J5.45 J7.45), HSADCircuit (IC5.39)
B34_IO_L24_P: MezzanineConnectors (J5.43 J7.43), HSADCircuit (IC5.40)
B35_IO_L19_N: MezzanineConnectors (J1.63 J3.63), HSDACircuit (IC6.5)
B35_IO_L19_P: MezzanineConnectors (J1.61 J3.61), HSDACircuit (IC6.4)
B35_IO_L23_N: MezzanineConnectors (J1.64 J3.64), HSDACircuit (IC6.7)
B35_IO_L23_P: MezzanineConnectors (J1.62 J3.62), HSDACircuit (IC6.6)
HS_ADC_CLK_N: ClockGen (C16.1), HSADCircuit (IC5.11 R17.1)
HS_ADC_CLK_P: ClockGen (C15.1), HSADCircuit (IC5.10 R17.2)
HS_ADC_OVR: HSADCircuit (IC5.3), SerialTerminations (IC8.3)
HS_ADC_RESET: HSADCircuit (IC5.30), SerialTerminations (IC8.4)
HS_ADC_SCLK: HSADCircuit (IC5.29), SerialTerminations (IC8.5)
HS_ADC_SDATA: HSADCircuit (IC5.28), SerialTerminations (IC8.6)
HS_ADC_SEN: HSADCircuit (IC5.27), SerialTerminations (IC8.7)
HS_DAC_CLK_N: ClockGen (C18.1), HSDACircuit (IC6.2 R19.1)
HS_DAC_CLK_P: ClockGen (C17.1), HSDACircuit (IC6.1 R19.2)
SPI_CS_DAC: HSDACircuit (IC6.42), SerialTerminations (IC7.6)
SPI_NRES_DAC: HSDACircuit (IC6.41), SerialTerminations (IC7.7)
SPI_SCK: HSDACircuit (IC6.43), SerialTerminations (IC7.5)
SPI_SDI: HSDACircuit (IC6.44), SerialTerminations (IC7.4)
SPI_SDO: HSDACircuit (IC6.46), SerialTerminations (IC7.3)
SYS_PG: HSADDAPower (IC1.4 IC2.4 IC3.4), MezzanineConnectors (J1.35 J3.35)